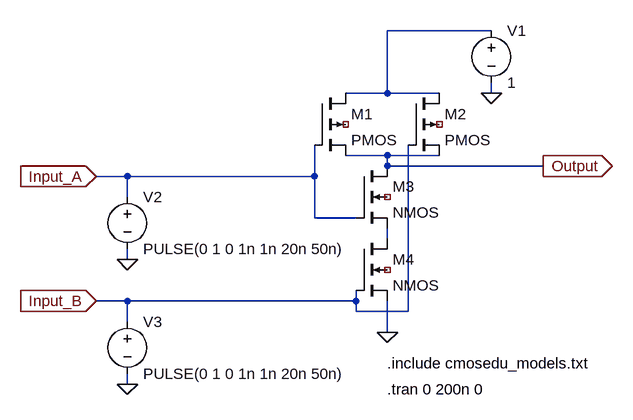
[diagram p0: schematic EXP_5 (NAND).asc]
EXP_5 (NAND).asc, the LTspice schematic file:
Version 4
SHEET 1 880 680
WIRE 384 -32 224 -32
WIRE 224 64 224 -32
WIRE 224 64 160 64
WIRE 304 64 224 64
WIRE 384 64 384 48
WIRE 224 160 160 160
WIRE 304 160 224 160
WIRE 224 176 224 160
WIRE 464 176 224 176
WIRE -176 192 -224 192
WIRE 112 192 112 144
WIRE 112 192 -176 192
WIRE -176 224 -176 192
WIRE 112 256 112 192
WIRE 176 256 112 256
WIRE 224 288 224 272
WIRE -176 320 -176 304
WIRE -176 384 -224 384
WIRE 176 384 176 368
WIRE 176 384 -176 384
WIRE 176 400 176 384
WIRE 256 400 256 144
WIRE 256 400 176 400
WIRE -176 416 -176 384
WIRE 224 432 224 384
WIRE -176 512 -176 496
FLAG 224 432 0
FLAG 384 64 0
FLAG -224 192 Input_A
IOPIN -224 192 In
FLAG -224 384 Input_B
IOPIN -224 384 In
FLAG 464 176 Output
IOPIN 464 176 Out
FLAG -176 320 0
FLAG -176 512 0
SYMBOL pmos4 112 64 R0
SYMATTR InstName M1
SYMBOL pmos4 256 64 R0
SYMATTR InstName M2
SYMBOL nmos4 176 176 R0
SYMATTR InstName M3
SYMBOL nmos4 176 288 R0
SYMATTR InstName M4
SYMBOL voltage 384 -48 R0
SYMATTR InstName V1
SYMATTR Value 1
SYMBOL voltage -176 208 R0
WINDOW 123 0 0 Left 0
WINDOW 39 0 0 Left 0
SYMATTR InstName V2
SYMATTR Value PULSE(0 1 0 1n 1n 20n 50n)
SYMBOL voltage -176 400 R0
WINDOW 123 0 0 Left 0
WINDOW 39 0 0 Left 0
SYMATTR InstName V3
SYMATTR Value PULSE(0 1 0 1n 1n 20n 50n)
TEXT 224 480 Left 2 !.include cmosedu_models.txt
TEXT 224 520 Left 2 !.tran 0 200n 0

The netlist it stands for:
* EXP_5 (NAND).asc
M1 N001 Input_A Output NC_01 PMOS
M2 N001 Input_B Output NC_02 PMOS
M3 Output Input_A N002 NC_03 NMOS
M4 N002 Input_B 0 NC_04 NMOS
V1 N001 0 1
V2 Input_A 0 PULSE(0 1 0 1n 1n 20n 50n)
V3 Input_B 0 PULSE(0 1 0 1n 1n 20n 50n)
.model NMOS NMOS
.model PMOS PMOS
.lib standard.mos
.include cmosedu_models.txt
.tran 0 200n 0
.backanno
.end